# Altium project MDrive.PrjPCB
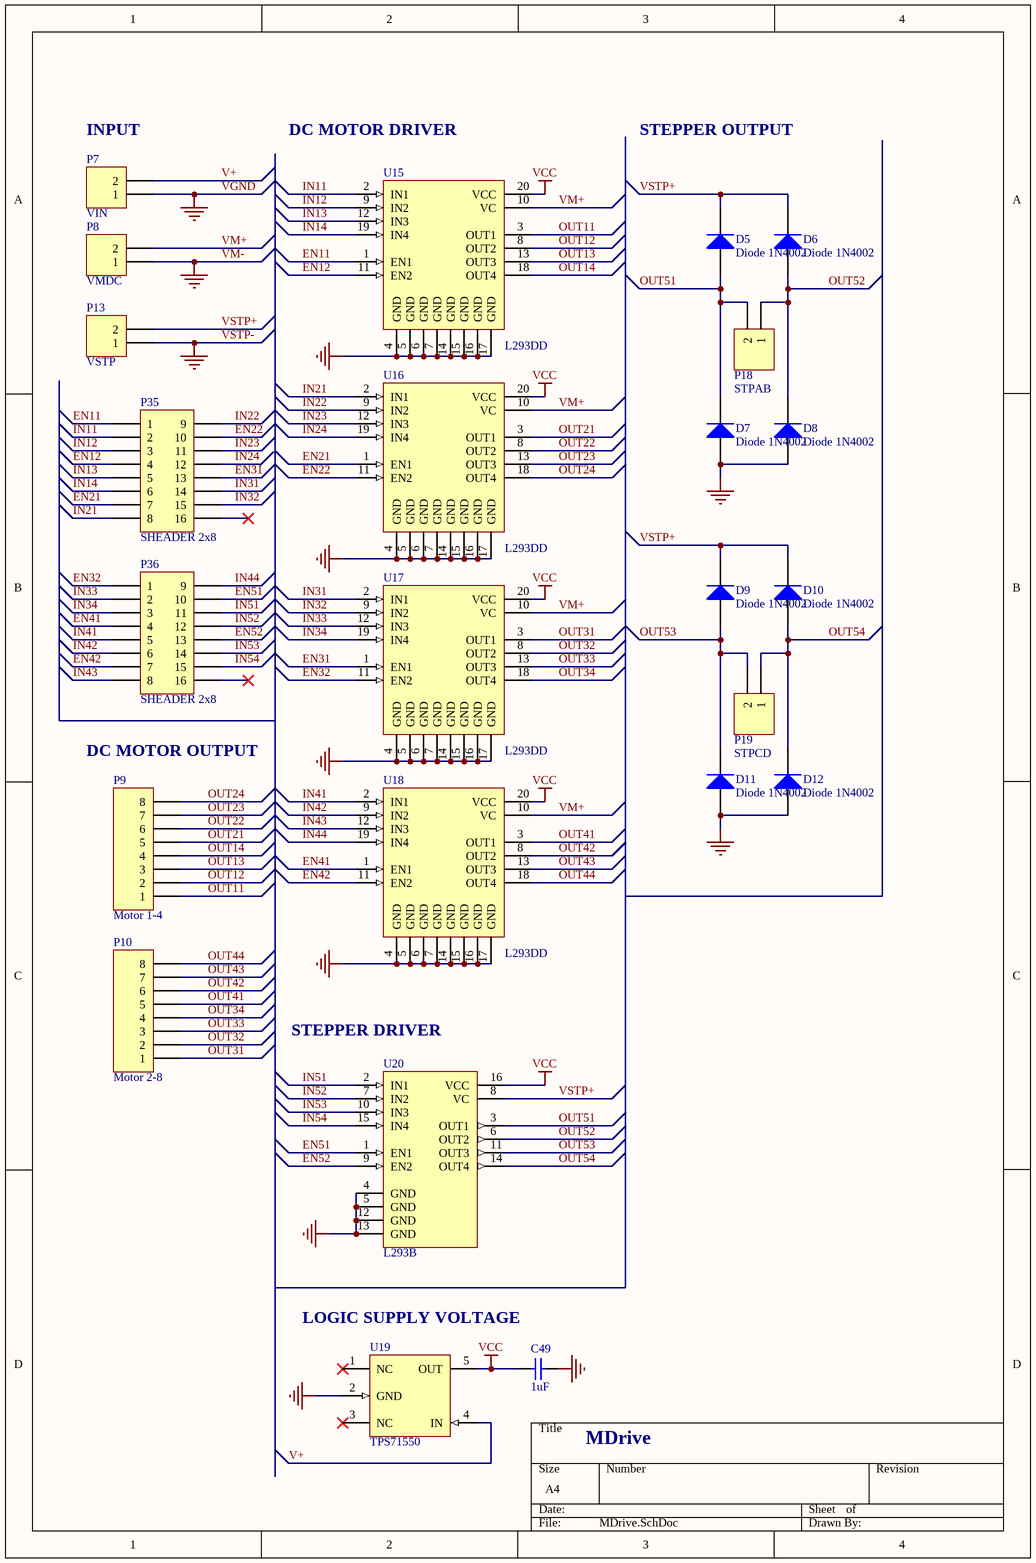
[diagram p0: MDrive.SchDoc]
1 sheet, 24 parts. Net scope: global (net labels, ports and power ports of the same name join across sheets).
Board file: MDriveFinal.PcbDoc

## Sheet MDrive.SchDoc: MDrive
size A4 portrait

### Parts
C49  value 1uF  [CAPC2012M]  (hidden comment: Cap Semi)
D5  Diode 1N4002  [DO-41]
D6  Diode 1N4002  [DO-41]
D7  Diode 1N4002  [DO-41]
D8  Diode 1N4002  [DO-41]
D9  Diode 1N4002  [DO-41]
D10  Diode 1N4002  [DO-41]
D11  Diode 1N4002  [DO-41]
D12  Diode 1N4002  [DO-41]
P7  VIN  [AZUL5-2]
P8  VMDC  [AZUL5-2]
P9  Motor 1-4  [AZUL5-8]
P10  Motor 2-8  [AZUL5-8]
P13  VSTP  [AZUL5-2]
P18  STPAB  [AZUL5-2]
P19  STPCD  [AZUL5-2]
P35  SHEADER 2x8  [SHBH 2X8]
P36  SHEADER 2x8  [SHBH 2X8]
U15  L293DD  [SO20_N]
U16  L293DD  [SO20_N]
U17  L293DD  [SO20_N]
U18  L293DD  [SO20_N]
U19  TPS71550  [SOT353-5L]
U20  L293B  [DIP16]

### Nets
VCC: C49.1 U15.20(VCC) U16.20(VCC) U17.20(VCC) U18.20(VCC) U19.5(OUT) U20.16(VCC)
VGND: C49.2 D7.1(A) D8.1(A) D11.1(A) D12.1(A) P7.1 P8.1 P13.1 U15.4(GND) U15.5(GND) U15.6(GND) U15.7(GND) U15.14(GND) U15.15(GND) U15.16(GND) U15.17(GND) U16.4(GND) U16.5(GND) U16.6(GND) U16.7(GND) U16.14(GND) U16.15(GND) U16.16(GND) U16.17(GND) U17.4(GND) U17.5(GND) U17.6(GND) U17.7(GND) U17.14(GND) U17.15(GND) U17.16(GND) U17.17(GND) U18.4(GND) U18.5(GND) U18.6(GND) U18.7(GND) U18.14(GND) U18.15(GND) U18.16(GND) U18.17(GND) U19.2(GND) U20.4(GND) U20.5(GND) U20.12(GND) U20.13(GND)  [also labelled GND, VM-, VSTP-]
EN11: P35.1 U15.1(EN1)
EN12: P35.4 U15.11(EN2)
EN21: P35.7 U16.1(EN1)
EN22: P35.10 U16.11(EN2)
EN31: P35.13 U17.1(EN1)
EN32: P36.1 U17.11(EN2)
EN41: P36.4 U18.1(EN1)
EN42: P36.7 U18.11(EN2)
EN51: P36.10 U20.1(EN1)
EN52: P36.13 U20.9(EN2)
IN11: P35.2 U15.2(IN1)
IN12: P35.3 U15.9(IN2)
IN13: P35.5 U15.12(IN3)
IN14: P35.6 U15.19(IN4)
IN21: P35.8 U16.2(IN1)
IN22: P35.9 U16.9(IN2)
IN23: P35.11 U16.12(IN3)
IN24: P35.12 U16.19(IN4)
IN31: P35.14 U17.2(IN1)
IN32: P35.15 U17.9(IN2)
IN33: P36.2 U17.12(IN3)
IN34: P36.3 U17.19(IN4)
IN41: P36.5 U18.2(IN1)
IN42: P36.6 U18.9(IN2)
IN43: P36.8 U18.12(IN3)
IN44: P36.9 U18.19(IN4)
IN51: P36.11 U20.2(IN1)
IN52: P36.12 U20.7(IN2)
IN53: P36.14 U20.10(IN3)
IN54: P36.15 U20.15(IN4)
OUT11: P9.1 U15.3(OUT1)
OUT12: P9.2 U15.8(OUT2)
OUT13: P9.3 U15.13(OUT3)
OUT14: P9.4 U15.18(OUT4)
OUT21: P9.5 U16.3(OUT1)
OUT22: P9.6 U16.8(OUT2)
OUT23: P9.7 U16.13(OUT3)
OUT24: P9.8 U16.18(OUT4)
OUT31: P10.1 U17.3(OUT1)
OUT32: P10.2 U17.8(OUT2)
OUT33: P10.3 U17.13(OUT3)
OUT34: P10.4 U17.18(OUT4)
OUT41: P10.5 U18.3(OUT1)
OUT42: P10.6 U18.8(OUT2)
OUT43: P10.7 U18.13(OUT3)
OUT44: P10.8 U18.18(OUT4)
OUT51: D5.1(A) D7.2(K) P18.2 U20.3(OUT1)
OUT52: D6.1(A) D8.2(K) P18.1 U20.6(OUT2)
OUT53: D9.1(A) D11.2(K) P19.2 U20.11(OUT3)
OUT54: D10.1(A) D12.2(K) P19.1 U20.14(OUT4)
V+: P7.2 U19.4(IN)
VM+: P8.2 U15.10(VC) U16.10(VC) U17.10(VC) U18.10(VC)
VSTP+: D5.2(K) D6.2(K) D9.2(K) D10.2(K) P13.2 U20.8(VC)

Not connected (* = marked no-connect by the designer): P35 16*; P36 16*; U19 1(NC)* 3(NC)*

### Notes on the sheet
- (near P7) INPUT
- DC MOTOR DRIVER
- STEPPER OUTPUT
- DC MOTOR OUTPUT
- (near U20) STEPPER DRIVER
- (near U19) LOGIC SUPPLY VOLTAGE

### Library data of the parts
C49 = Cap Semi: Capacitor (Semiconductor SIM Model); Published: 8-Jun-2000; LatestRevisionDate: 29-May-2009; LatestRevisionNote: IPC-7351 Footprint Added.; PackageReference: C1206; Publisher: Altium Limited; PackageDescription: Chip Capacitor
D5-D12 = Diode 1N4002: 1 Amp General Purpose Rectifier; Published: 8-Jun-2000; LatestRevisionDate: 17-Jul-2002; LatestRevisionNote: Re-released for DXP Platform.; DatasheetVersion: 1998; PackageVersion: Aug-1999; PackageReference: DO-41; Publisher: Altium Limited; PackageDescription: Diode, Axial; Body 5.2 x 2.7 mm (LxDia. max), Lead Dia. 0.86 mm (max); Code_JEDEC: DO-204-AL; ComponentLink1Description: Manufacturer Link; ComponentLink1URL: http://www.fairchildsemi.com/; ComponentLink2Description: Datasheet; ComponentLink2URL: http://www.fairchildsemi.com/ds/1N%2F1N4001.pdf
P7 P8 P13 P18 P19 = Header 2: Header, 2-Pin; LatestRevisionDate: 17-Jul-2002; LatestRevisionNote: Re-released for DXP Platform.; Publisher: Altium Limited
P9 P10 = Header 8: Header, 8-Pin; LatestRevisionDate: 17-Jul-2002; LatestRevisionNote: Re-released for DXP Platform.; Publisher: Altium Limited
P35 P36 = SB Header 2x8: Shrouded Box Header: 2x8-Pin, 0.100" (2.54 mm) Male
U15-U18 = L293DD: Push-Pull Four Channel Driver With Diode; Published: 8-Jun-2000; LatestRevisionDate: 13-Apr-2006; LatestRevisionNote: IPC-7351 Footprint Added.; DatasheetVersion: Jun-1996; PackageVersion: Jul-2001; PackageReference: SO20; Publisher: Altium Limited; PackageDescription: 20-Pin Plastic Small Outline Integrated Circuit 1.27 mm Pitch; Code_JEDEC: MS-013-AC; Code_IPC: SOIC127P1030-20; ComponentLink1Description: Manufacturer Link; ComponentLink1URL: http://www.st.com/; ComponentLink2Description: Datasheet; ComponentLink2URL: http://www.st.com/stonline/products/literature/ds/1330/l293d.pdf
U20 = L293B: Push-Pull Four Channel Drivers; Published: 8-Jun-2000; LatestRevisionDate: 06-Jun-2005; LatestRevisionNote: Stylized 3D Model Added.; DatasheetVersion: Apr-1993; PackageVersion: Apr-1996; PackageReference: DIP16; Publisher: Altium Limited; PackageDescription: DIP; 16 Leads; Row Spacing 7.62 mm; Pitch 2.54 mm; ComponentLink1Description: Manufacturer Link; ComponentLink1URL: http://www.st.com/; ComponentLink2Description: Datasheet; ComponentLink2URL: http://www.st.com/stonline/products/literature/ds/1328/l293b.pdf